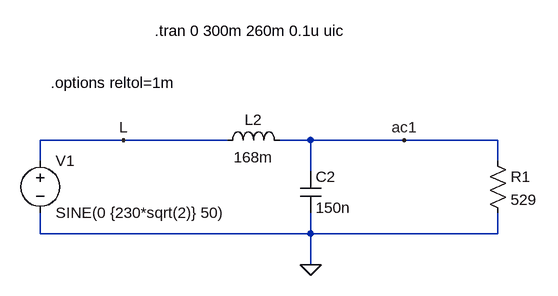
[diagram p0: schematic 3.- EMI Filter.asc]
3.- EMI Filter.asc, the LTspice schematic file:
Version 4
SHEET 1 1108 1012
WIRE -544 48 -672 48
WIRE -384 48 -544 48
WIRE -256 48 -304 48
WIRE -112 48 -256 48
WIRE 32 48 -112 48
WIRE -672 80 -672 48
WIRE 32 80 32 48
WIRE -256 96 -256 48
WIRE -672 192 -672 160
WIRE -256 192 -256 160
WIRE -256 192 -672 192
WIRE 32 192 32 160
WIRE 32 192 -256 192
WIRE -256 240 -256 192
FLAG -112 48 ac1
FLAG -256 240 0
FLAG -544 48 L
SYMBOL voltage -672 64 R0
WINDOW 123 0 0 Left 0
WINDOW 39 0 0 Left 0
SYMATTR InstName V1
SYMATTR Value SINE(0 {230*sqrt(2)} 50)
SYMBOL ind -400 64 R270
WINDOW 0 32 56 VTop 2
WINDOW 3 5 56 VBottom 2
SYMATTR InstName L2
SYMATTR Value 168m
SYMBOL cap -272 96 R0
SYMATTR InstName C2
SYMATTR Value 150n
SYMBOL res 16 64 R0
SYMATTR InstName R1
SYMATTR Value 529
TEXT -496 -120 Left 2 !.tran 0 300m 260m 0.1u uic
TEXT -656 -40 Left 2 !.options reltol=1m

The netlist it stands for:
* 3.- EMI Filter.asc
V1 L 0 SINE(0 {230*sqrt(2)} 50)
L2 L ac1 168m
C2 ac1 0 150n
R1 ac1 0 529
.tran 0 300m 260m 0.1u uic
.options reltol=1m
.backanno
.end